# EAGLE schematic Smersh2 (EAGLE 9.1.3)
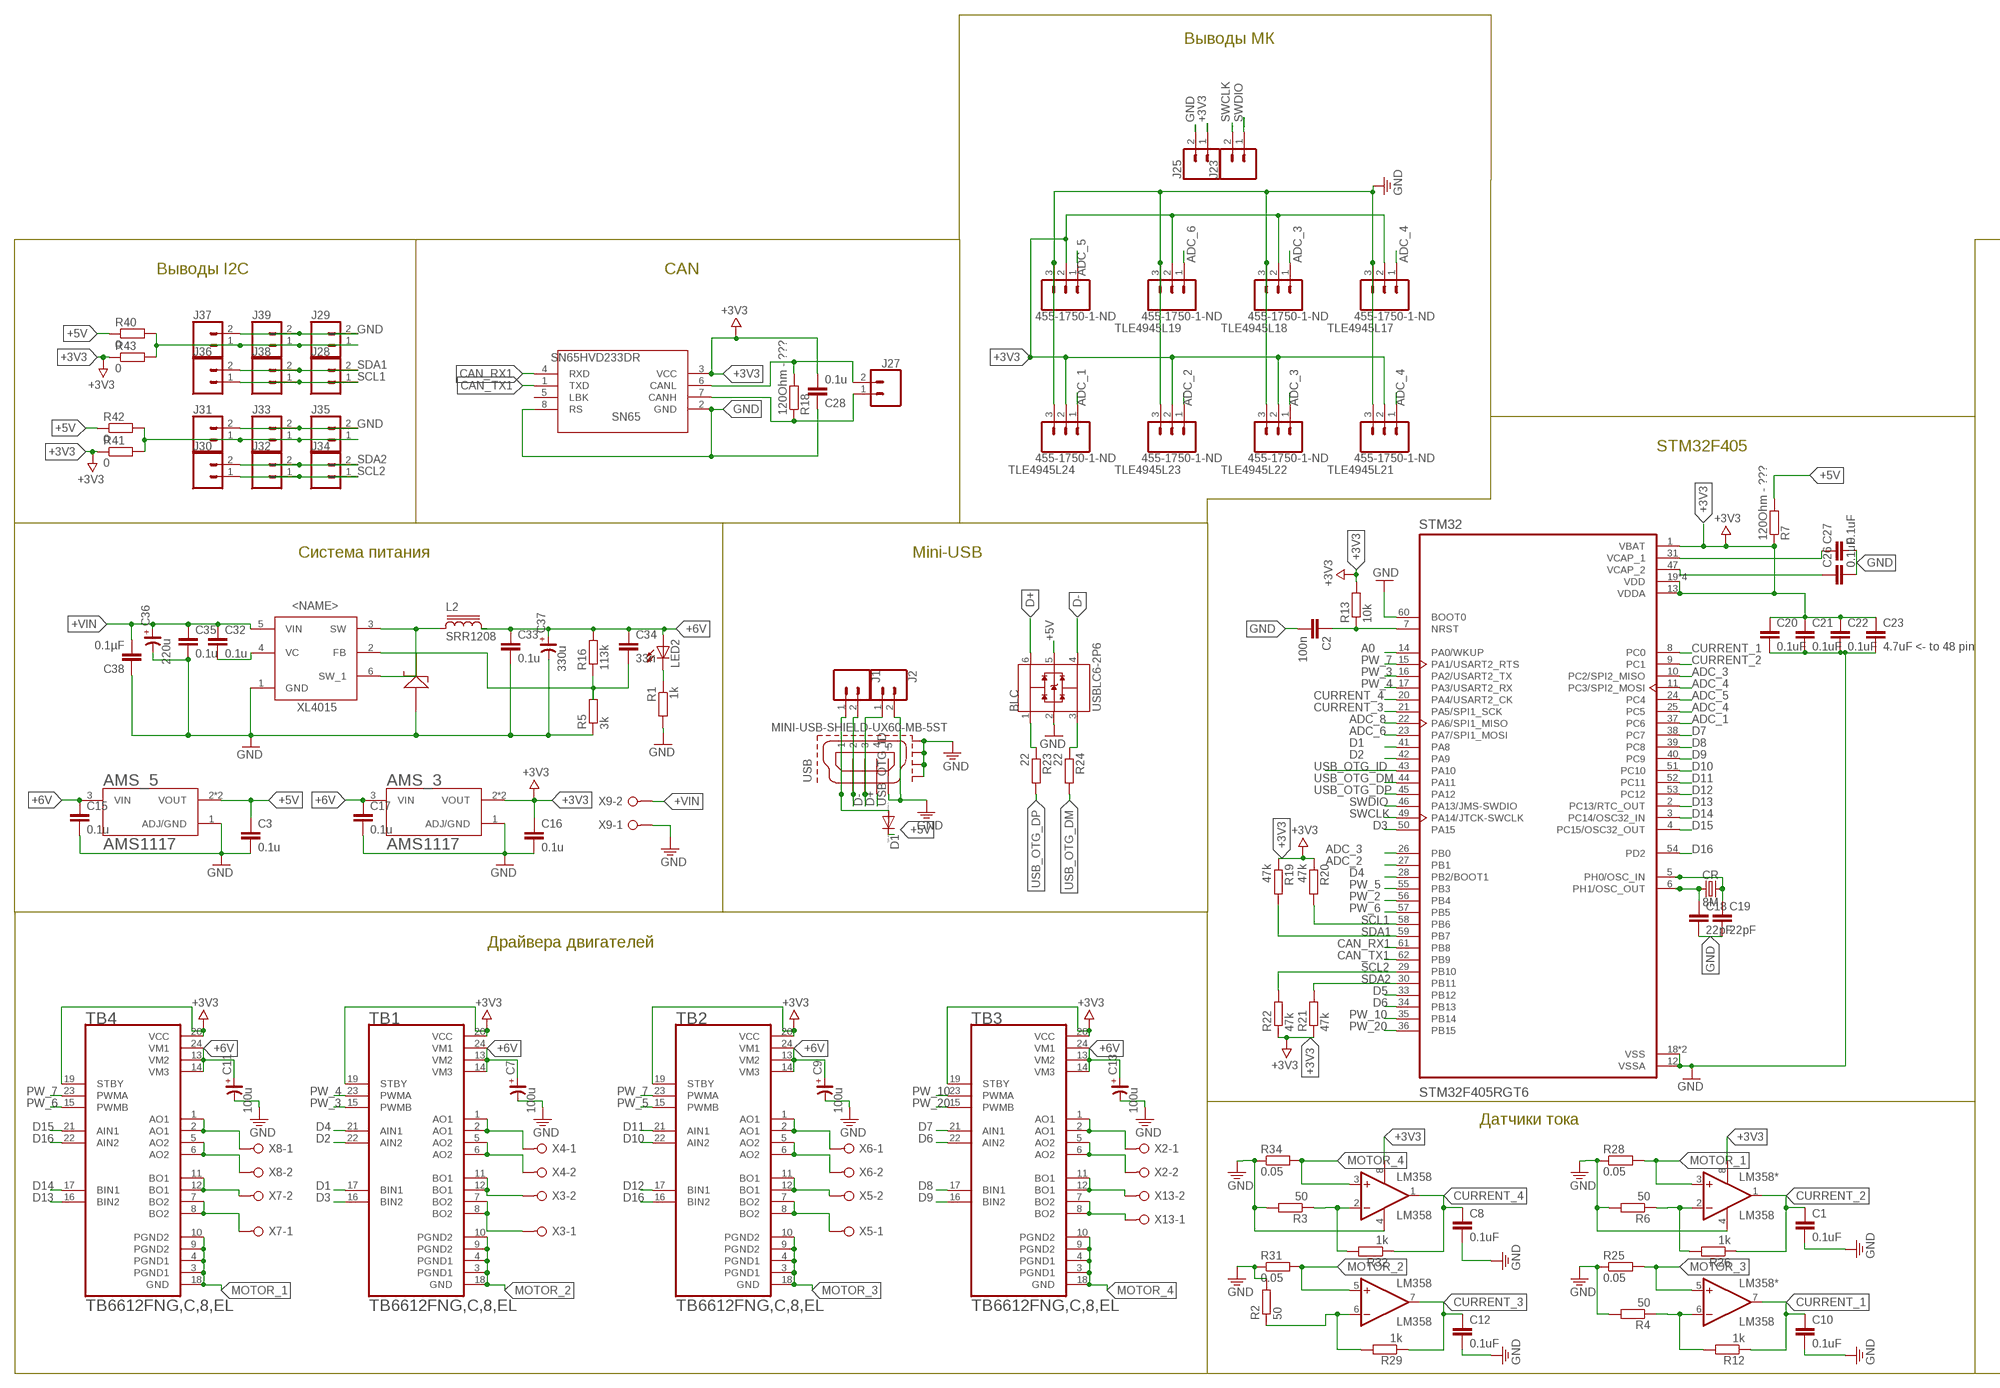
[diagram p0: schematic, sheet 1, part 1 of 2]
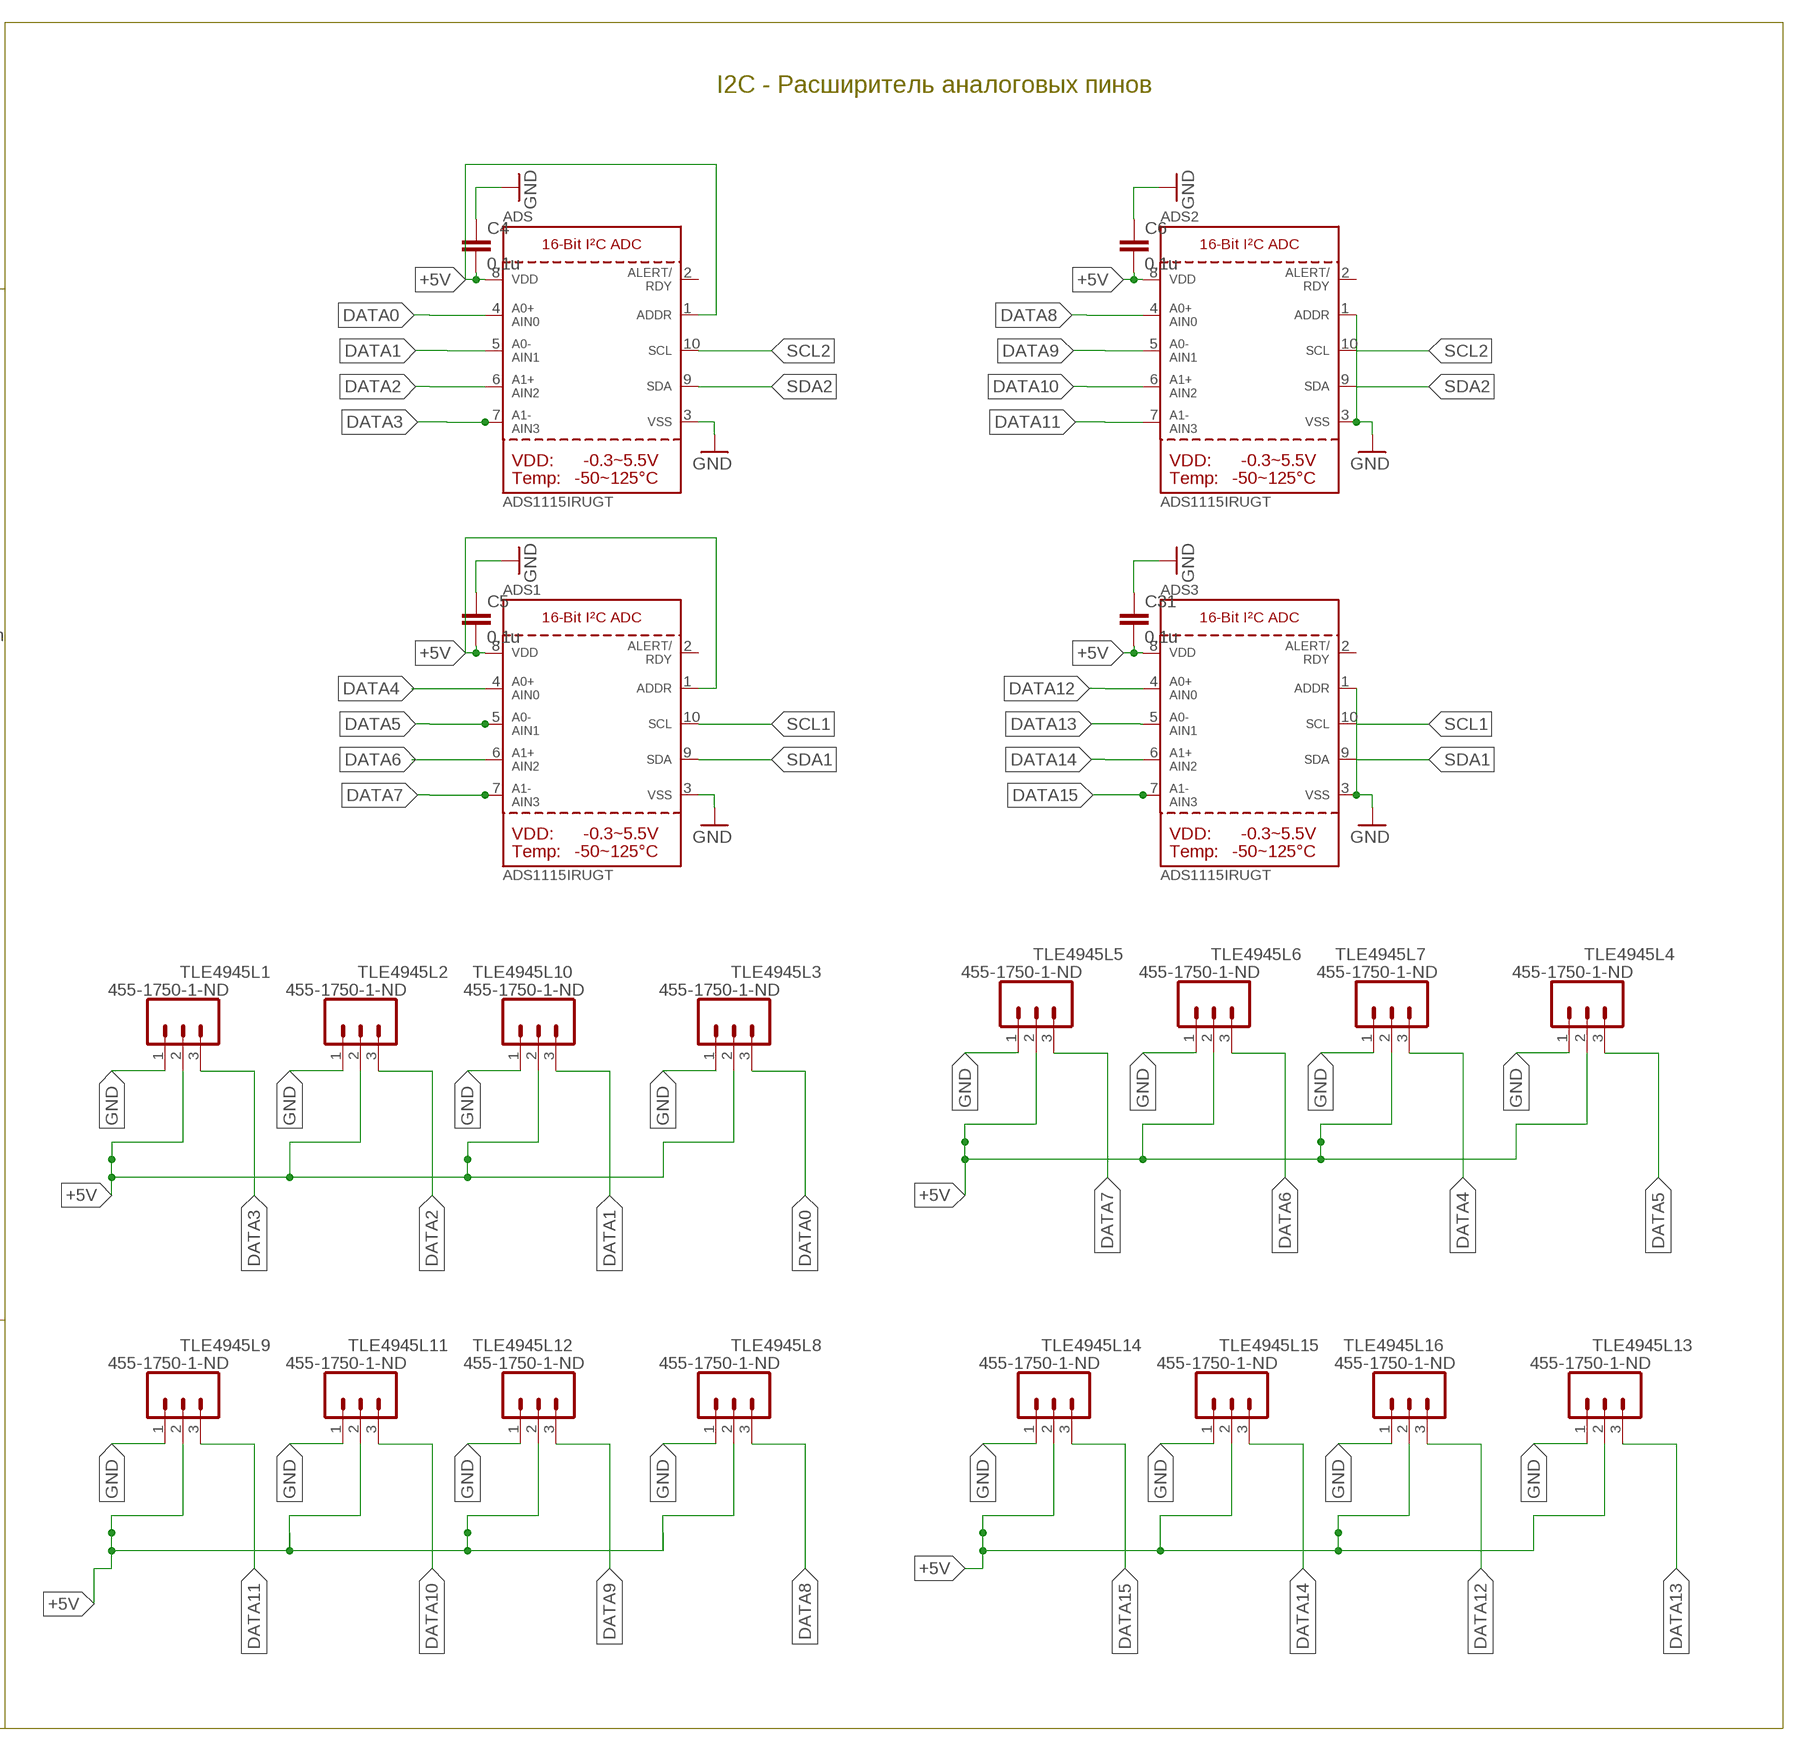
[diagram p1: schematic, sheet 1, part 2 of 2]

## Parts
ADS  ADS1115IRUGT  [MSOP10]
ADS1  ADS1115IRUGT  [MSOP10]
ADS2  ADS1115IRUGT  [MSOP10]
ADS3  ADS1115IRUGT  [MSOP10]
AMS_3  AMS1117  [SOT229P700X180-4N]
AMS_5  AMS1117  [SOT229P700X180-4N]
BLC  USBLC6-2P6  [SOT50P160X60-6N]
C1  0.1uF  C-EUC0603  [C0603]
C2  100n  C-EUC0603  [C0603]
C3  0.1u  C-EUC0805  [C0805]
C4  0.1u  C-EUC0805  [C0805]
C5  0.1u  C-EUC0805  [C0805]
C6  0.1u  C-EUC0805  [C0805]
C7  100u  CP_SV-B  [CSV-B]
C8  0.1uF  C-EUC0603  [C0603]
C9  100u  CP_SV-B  [CSV-B]
C10  0.1uF  C-EUC0603  [C0603]
C11  100u  CP_SV-B  [CSV-B]
C12  0.1uF  C-EUC0603  [C0603]
C13  100u  CP_SV-B  [CSV-B]
C15  0.1u  C-EUC0805  [C0805]
C16  0.1u  C-EUC0805  [C0805]
C17  0.1u  C-EUC0805  [C0805]
C18  22pF  C-EUC0603  [C0603]
C19  22pF  C-EUC0603  [C0603]
C20  0.1uF  C-EUC0805  [C0805]
C21  0.1uF  C-EUC0603  [C0603]
C22  0.1uF  C-EUC0805  [C0805]
C23  4.7uF <- to 48 pin  C-EUC0805  [C0805]
C26  0.1uF  C-EUC0603  [C0603]
C27  0.1uF  C-EUC0603  [C0603]
C28  0.1u  C-EUC0805  [C0805]
C31  0.1u  C-EUC0805  [C0805]
C32  0.1u  C-EUC0805  [C0805]
C33  0.1u  C-EUC0805  [C0805]
C34  33n  C-EUC0805  [C0805]
C35  0.1u  C-EUC0805  [C0805]
C36  220u  CP_SV-D  [CSV-D]
C37  330u  CP_SV-D  [CSV-D]
C38  0.1µF  C-EUC0805  [C0805]
CR  8M  CRYSTALSMD-3.2X2.5  [CRYSTAL-SMD-3.2X2.5MM]
D1  DIODE-MELF-MLL41  [MELF-MLL41]
DIOD  SK54  [DO214AA]
J1  CONN_02  [1X02]
J2  CONN_02  [1X02]
J23  CONN_02  [1X02]
J25  CONN_02  [1X02]
J27  CONN_02  [1X02]
J28  CONN_02  [1X02]
J29  CONN_02  [1X02]
J30  CONN_02  [1X02]
J31  CONN_02  [1X02]
J32  CONN_02  [1X02]
J33  CONN_02  [1X02]
J34  CONN_02  [1X02]
J35  CONN_02  [1X02]
J36  CONN_02  [1X02]
J37  CONN_02  [1X02]
J38  CONN_02  [1X02]
J39  CONN_02  [1X02]
L2  SRR1208  [SSR1208]
LED2  LEDCHIPLED_0805  [CHIPLED_0805]
LM358  LM358  [LM358]
LM358*  LM358  [LM358]
R1  1k  R-EU_R0805  [R0805]
R2  50  R-EU_R0603  [R0603]
R3  50  R-EU_R0603  [R0603]
R4  50  R-EU_R1206  [R1206]
R5  3k  R-EU_M0805  [M0805]
R6  50  R-EU_R0603  [R0603]
R7  120Ohm - ???  R-EU_R0805  [R0805]
R12  1k  R-EU_R0603  [R0603]
R13  10k  R-EU_R0603  [R0603]
R16  113k  R-EU_M0805  [M0805]
R18  120Ohm - ???  R-EU_R0805  [R0805]
R19  47k  R-EU_R0805  [R0805]
R20  47k  R-EU_R0805  [R0805]
R21  47k  R-EU_R0805  [R0805]
R22  47k  R-EU_R0805  [R0805]
R23  22  R-EU_R0805  [R0805]
R24  22  R-EU_R0805  [R0805]
R25  0.05  R-EU_R1206  [R1206]
R26  1k  R-EU_R0603  [R0603]
R28  0.05  R-EU_R1206  [R1206]
R29  1k  R-EU_R0603  [R0603]
R31  0.05  R-EU_R1206  [R1206]
R32  1k  R-EU_R0603  [R0603]
R34  0.05  R-EU_R1206  [R1206]
R40  0  R-EU_R0805  [R0805]
R41  0  R-EU_R0805  [R0805]
R42  0  R-EU_R0805  [R0805]
R43  0  R-EU_R0805  [R0805]
SN65  SN65HVD233DR  [SOIC8]
STM32  STM32F405RGT6  [QFP50P1200X1200X160-64N]
TB1  TB6612FNG,C,8,EL  [SOP65P760X160-24N]
TB2  TB6612FNG,C,8,EL  [SOP65P760X160-24N]
TB3  TB6612FNG,C,8,EL  [SOP65P760X160-24N]
TB4  TB6612FNG,C,8,EL  [SOP65P760X160-24N]
TLE4945L1  455-1750-1-ND  CONN_03  [1X03]
TLE4945L2  455-1750-1-ND  CONN_03  [1X03]
TLE4945L3  455-1750-1-ND  CONN_03  [1X03]
TLE4945L4  455-1750-1-ND  CONN_03  [1X03]
TLE4945L5  455-1750-1-ND  CONN_03  [1X03]
TLE4945L6  455-1750-1-ND  CONN_03  [1X03]
TLE4945L7  455-1750-1-ND  CONN_03  [1X03]
TLE4945L8  455-1750-1-ND  CONN_03  [1X03]
TLE4945L9  455-1750-1-ND  CONN_03  [1X03]
TLE4945L10  455-1750-1-ND  CONN_03  [1X03]
TLE4945L11  455-1750-1-ND  CONN_03  [1X03]
TLE4945L12  455-1750-1-ND  CONN_03  [1X03]
TLE4945L13  455-1750-1-ND  CONN_03  [1X03]
TLE4945L14  455-1750-1-ND  CONN_03  [1X03]
TLE4945L15  455-1750-1-ND  CONN_03  [1X03]
TLE4945L16  455-1750-1-ND  CONN_03  [1X03]
TLE4945L17  455-1750-1-ND  CONN_03  [1X03]
TLE4945L18  455-1750-1-ND  CONN_03  [1X03]
TLE4945L19  455-1750-1-ND  CONN_03  [1X03]
TLE4945L20  455-1750-1-ND  CONN_03  [1X03]
TLE4945L21  455-1750-1-ND  CONN_03  [1X03]
TLE4945L22  455-1750-1-ND  CONN_03  [1X03]
TLE4945L23  455-1750-1-ND  CONN_03  [1X03]
TLE4945L24  455-1750-1-ND  CONN_03  [1X03]
USB  MINI-USB-SHIELD-UX60-MB-5ST  [UX60-MB-5ST]
X2  W237-02P  [W237-132]
X3  W237-02P  [W237-132]
X4  W237-02P  [W237-132]
X5  W237-02P  [W237-132]
X6  W237-02P  [W237-132]
X7  W237-02P  [W237-132]
X8  W237-02P  [W237-132]
X9  W237-02P  [W237-132]
X13  W237-02P  [W237-132]
XL4015  XL4015  [TO263-5L]

## Nets
+3V3: AMS_3.2(VOUT) AMS_3.4(VOUT) C16.1 C20.1 C21.1 C22.1 C23.1 C28.2 J25.1 LM358*.8(V+) LM358.8(V+) R7.1 R13.2 R19.1 R20.1 R21.1 R22.1 R41.1 R43.1 SN65.3(VCC) STM32.1(VBAT) STM32.13(VDDA) STM32.19(VDD) STM32.32(VDD) STM32.48(VDD) STM32.64(VDD) TB1.19(STBY) TB1.20(VCC) TB2.19(STBY) TB2.20(VCC) TB3.19(STBY) TB3.20(VCC) TB4.19(STBY) TB4.20(VCC) TLE4945L17.2 TLE4945L18.2 TLE4945L19.2 TLE4945L20.2 TLE4945L21.2 TLE4945L22.2 TLE4945L23.2 TLE4945L24.2
+5V: ADS1.1(ADDR) ADS1.8(VDD) ADS2.8(VDD) ADS3.8(VDD) ADS.1(ADDR) ADS.8(VDD) AMS_5.2(VOUT) AMS_5.4(VOUT) BLC.5(VBUS) C3.1 C4.2 C5.2 C6.2 C31.2 D1.C R7.2 R40.1 R42.1 TLE4945L1.2 TLE4945L2.2 TLE4945L3.2 TLE4945L4.2 TLE4945L5.2 TLE4945L6.2 TLE4945L7.2 TLE4945L8.2 TLE4945L9.2 TLE4945L10.2 TLE4945L11.2 TLE4945L12.2 TLE4945L13.2 TLE4945L14.2 TLE4945L15.2 TLE4945L16.2
+6V: AMS_3.3(VIN) AMS_5.3(VIN) C7.+ C9.+ C11.+ C13.+ C15.1 C17.1 C33.1 C34.1 C37.+ L2.2 LED2.A R16.2 TB1.13(VM2) TB1.14(VM3) TB1.24(VM1) TB2.13(VM2) TB2.14(VM3) TB2.24(VM1) TB3.13(VM2) TB3.14(VM3) TB3.24(VM1) TB4.13(VM2) TB4.14(VM3) TB4.24(VM1)
+VIN: C32.1 C35.1 C36.+ C38.2 X9.2 XL4015.5(VIN)
A0: STM32.14(PA0/WKUP)
ADC_1: STM32.37(PC6) TLE4945L24.1
ADC_2: STM32.27(PB1) TLE4945L23.1
ADC_3: STM32.10(PC2/SPI2_MISO) STM32.26(PB0) TLE4945L18.1 TLE4945L22.1
ADC_4: STM32.11(PC3/SPI2_MOSI) STM32.25(PC5) TLE4945L17.1 TLE4945L21.1
ADC_5: STM32.24(PC4) TLE4945L20.1
ADC_6: STM32.23(PA7/SPI1_MOSI) TLE4945L19.1
ADC_8: STM32.22(PA6/SPI1_MISO)
CAN_RX1: SN65.4(RXD) STM32.61(PB8)
CAN_TX1: SN65.1(TXD) STM32.62(PB9)
CANH2: J27.1 R18.1 SN65.7(CANH)
CANL2: J27.2 R18.2 SN65.6(CANL)
CURRENT_1: C10.1 LM358*.7(OUT1) R12.1 STM32.8(PC0)
CURRENT_2: C1.1 LM358*.1(OUT) R26.1 STM32.9(PC1)
CURRENT_3: C12.1 LM358.7(OUT1) R29.1 STM32.21(PA5/SPI1_SCK)
CURRENT_4: C8.1 LM358.1(OUT) R32.1 STM32.20(PA4/USART2_CK)
D1: STM32.41(PA8) TB1.17(BIN1)
D2: STM32.42(PA9) TB1.22(AIN2)
D3: STM32.50(PA15) TB1.16(BIN2)
D4: STM32.28(PB2/BOOT1) TB1.21(AIN1)
D5: STM32.33(PB12)
D6: STM32.34(PB13) TB3.22(AIN2)
D7: STM32.38(PC7) TB3.21(AIN1)
D8: STM32.39(PC8) TB3.17(BIN1)
D9: STM32.40(PC9) TB3.16(BIN2)
D10: STM32.51(PC10) TB2.22(AIN2)
D11: STM32.52(PC11) TB2.21(AIN1)
D12: STM32.53(PC12) TB2.17(BIN1)
D13: STM32.2(PC13/RTC_OUT) TB4.16(BIN2)
D14: STM32.3(PC14/OSC32_IN) TB4.17(BIN1)
D15: STM32.4(PC15/OSC32_OUT) TB4.21(AIN1)
D16: STM32.54(PD2) TB2.16(BIN2) TB4.22(AIN2)
D+: BLC.6(I/O1_2) J2.1 USB.3
D-: BLC.4(I/O2_2) J1.2 USB.2
DATA0: ADS.4(AIN0) TLE4945L3.3
DATA1: ADS.5(AIN1) TLE4945L10.3
DATA2: ADS.6(AIN2) TLE4945L2.3
DATA3: ADS.7(AIN3) TLE4945L1.3
DATA4: ADS1.4(AIN0) TLE4945L7.3
DATA5: ADS1.5(AIN1) TLE4945L4.3
DATA6: ADS1.6(AIN2) TLE4945L6.3
DATA7: ADS1.7(AIN3) TLE4945L5.3
DATA8: ADS2.4(AIN0) TLE4945L8.3
DATA9: ADS2.5(AIN1) TLE4945L12.3
DATA10: ADS2.6(AIN2) TLE4945L11.3
DATA11: ADS2.7(AIN3) TLE4945L9.3
DATA12: ADS3.4(AIN0) TLE4945L16.3
DATA13: ADS3.5(AIN1) TLE4945L13.3
DATA14: ADS3.6(AIN2) TLE4945L15.3
DATA15: ADS3.7(AIN3) TLE4945L14.3
GND: ADS1.3(VSS) ADS2.1(ADDR) ADS2.3(VSS) ADS3.1(ADDR) ADS3.3(VSS) ADS.3(VSS) AMS_3.1(ADJ/GND) AMS_5.1(ADJ/GND) BLC.2(GND) C1.2 C2.2 C3.2 C4.1 C5.1 C6.1 C7.- C8.2 C9.- C10.2 C11.- C12.2 C13.- C15.2 C16.2 C17.2 C18.2 C19.2 C20.2 C21.2 C22.2 C23.2 C26.2 C27.2 C28.1 C31.1 C33.2 C35.2 C36.- C37.- C38.1 DIOD.A J2.2 J25.2 J29.2 J31.2 J33.2 J35.2 J37.2 J39.2 LM358*.4(V-) LM358.4(V-) R1.2 R2.2 R3.2 R4.2 R5.1 R6.2 R25.1 R28.1 R31.1 R34.1 SN65.2(GND) SN65.8(RS) STM32.12(VSSA) STM32.18(VSS) STM32.60(BOOT0) STM32.63(VSS) TLE4945L1.1 TLE4945L2.1 TLE4945L3.1 TLE4945L4.1 TLE4945L5.1 TLE4945L6.1 TLE4945L7.1 TLE4945L8.1 TLE4945L9.1 TLE4945L10.1 TLE4945L11.1 TLE4945L12.1 TLE4945L13.1 TLE4945L14.1 TLE4945L15.1 TLE4945L16.1 TLE4945L17.3 TLE4945L18.3 TLE4945L19.3 TLE4945L20.3 TLE4945L21.3 TLE4945L22.3 TLE4945L23.3 TLE4945L24.3 USB.5 USB.M1(GND1) USB.M2(GND2) USB.M3(GND3) USB.M4(GND4) X9.1 XL4015.1(GND)
MOTOR_1: LM358*.3(+IN) R28.2 TB4.3(PGND1) TB4.4(PGND1) TB4.9(PGND2) TB4.10(PGND2) TB4.18(GND)
MOTOR_2: LM358.5(+IN1) R31.2 TB1.3(PGND1) TB1.4(PGND1) TB1.9(PGND2) TB1.10(PGND2) TB1.18(GND)
MOTOR_3: LM358*.5(+IN1) R25.2 TB2.3(PGND1) TB2.4(PGND1) TB2.9(PGND2) TB2.10(PGND2) TB2.18(GND)
MOTOR_4: LM358.3(+IN) R34.2 TB3.3(PGND1) TB3.4(PGND1) TB3.9(PGND2) TB3.10(PGND2) TB3.18(GND)
N$2: LED2.C R1.1
N$3: D1.A J1.1 USB.1
N$6: TB1.1(AO1) TB1.2(AO1) X4.1
N$7: C32.2 XL4015.4(VC)
N$8: TB1.5(AO2) TB1.6(AO2) X4.2
N$9: DIOD.C L2.1 XL4015.3(SW) XL4015.6(SW_1)
N$10: TB1.11(BO1) TB1.12(BO1) X3.2
N$11: TB1.7(BO2) TB1.8(BO2) X3.1
N$12: C2.1 R13.1 STM32.7(NRST)
N$13: C19.1 CR.3 STM32.5(PH0/OSC_IN)
N$14: TB2.1(AO1) TB2.2(AO1) X6.1
N$15: TB2.5(AO2) TB2.6(AO2) X6.2
N$16: C18.1 CR.1 STM32.6(PH1/OSC_OUT)
N$18: TB2.11(BO1) TB2.12(BO1) X5.2
N$22: C26.1 STM32.47(VCAP_2)
N$23: TB2.7(BO2) TB2.8(BO2) X5.1
N$29: LM358*.6(-IN1) R4.1 R12.2
N$31: LM358*.2(-IN) R6.1 R26.2
N$32: C34.2 R5.2 R16.1 XL4015.2(FB)
N$33: TB4.1(AO1) TB4.2(AO1) X8.1
N$34: TB4.5(AO2) TB4.6(AO2) X8.2
N$35: TB4.11(BO1) TB4.12(BO1) X7.2
N$36: TB4.7(BO2) TB4.8(BO2) X7.1
N$38: LM358.6(-IN1) R2.1 R29.2
N$41: TB3.1(AO1) TB3.2(AO1) X2.1
N$42: TB3.5(AO2) TB3.6(AO2) X2.2
N$43: TB3.11(BO1) TB3.12(BO1) X13.2
N$44: TB3.7(BO2) TB3.8(BO2) X13.1
N$45: C27.1 STM32.31(VCAP_1)
N$48: LM358.2(-IN) R3.1 R32.2
N$49: BLC.1(I/O1_1) R23.1
N$50: BLC.3(I/O2_1) R24.1
N$53: J31.1 J33.1 J35.1 R41.2 R42.2
N$55: J29.1 J37.1 J39.1 R40.2 R43.2
PW_2: STM32.56(PB4)
PW_3: STM32.16(PA2/USART2_TX) TB1.15(PWMB)
PW_4: STM32.17(PA3/USART2_RX) TB1.23(PWMA)
PW_5: STM32.55(PB3) TB2.15(PWMB)
PW_6: STM32.57(PB5) TB4.15(PWMB)
PW_7: STM32.15(PA1/USART2_RTS) TB2.23(PWMA) TB4.23(PWMA)
PW_10: STM32.35(PB14) TB3.23(PWMA)
PW_20: STM32.36(PB15) TB3.15(PWMB)
SCL1: ADS1.10(SCL) ADS3.10(SCL) J28.1 J36.1 J38.1 R20.2 STM32.58(PB6)
SCL2: ADS2.10(SCL) ADS.10(SCL) J30.1 J32.1 J34.1 R22.2 STM32.29(PB10)
SDA1: ADS1.9(SDA) ADS3.9(SDA) J28.2 J36.2 J38.2 R19.2 STM32.59(PB7)
SDA2: ADS2.9(SDA) ADS.9(SDA) J30.2 J32.2 J34.2 R21.2 STM32.30(PB11)
SWCLK: J23.2 STM32.49(PA14/JTCK-SWCLK)
SWDIO: J23.1 STM32.46(PA13/JMS-SWDIO)
USB_OTG_DM: R24.2 STM32.44(PA11)
USB_OTG_DP: R23.2 STM32.45(PA12)
USB_OTG_ID: STM32.43(PA10) USB.4
Unconnected: ADS1.2(ALERT/RDY) ADS2.2(ALERT/RDY) ADS3.2(ALERT/RDY) ADS.2(ALERT/RDY) SN65.5(LBK)

## Notes on the sheet
- Выводы МК
- Выводы I2C | CAN
- Фитолента | I2C - Расширитель аналоговых пинов
- STM32F405
- Система питания | Mini-USB
- Драйвера двигателей
- Датчики тока

## Library data of the parts
ADS ADS1-ADS3 = ADS1115IRUGT:ADS1115IRUGT: 16-Bit Del-Sig ADC Four single-ended inputs or two differential inputs Internal PGA I2C interface 2.0-5.5V; AVAILABILITY: Unavailable; DESCRIPTION: 16 Bit Analog to Digital Converter 2, 4 Input 1 Sigma-Delta 10-X2QFN _2x1.5_; MF: Texas Instruments; MP: ADS1115IRUGT; PACKAGE: XFQFN-10 Texas Instruments; PRICE: None
AMS_3 AMS_5 = AMS1117:AMS1117: Sot223/Pkg 1-Amp 5-Volt Low Drop Out Voltage Regulatator; AVAILABILITY: Unavailable; DESCRIPTION: 1A LOW DROPOUT VOLTAGE REGULATOR; MF: Seeed Technology; MP: AMS1117; PACKAGE: SOT-223 Seeed Technology; PRICE: None
BLC = USBLC6-2P6:USBLC6-2P6: The USBLC6-2SC6 and USBLC6-2P6 are monolithic application specific devices dedicated to ESD protection of high speed interfaces, such as USB 2.0, Ethernet links and video lines. The very low line capacitance secures a high level of signal integrity without compromising in protecting sensitive chips against the most stringently characterized ESD strikes; AVAILABILITY: Unavailable; DESCRIPTION: 17V Clamp 5A _8/20µs_ Ipp Tvs Diode Surface Mount SOT-666; MF: STMicroelectronics; MP: USBLC62P6; PACKAGE: SOT-563 STMicroelectronics; PRICE: None
C1-C6 C8 C10 C12 C15-C23 C26-C28 C31-C35 = resistor:C-EU: CAPACITOR, European symbol
C7 C9 C11 C13 C36 C37 = rc-master-smd:CP_: POLARIZED CAP
C38 = rcl:C-EU: CAPACITOR, European symbol
CR = SparkFun-Clocks:CRYSTAL: Crystals (Generic) These are passive quartz crystals, which can be used as a clock source for a microcontroller. Crystal's are two-terminal devices. They require external "load" capacitors to generate an oscillating signal.
D1 = diode:DIODE-: DIODE
DIOD = DO214AA:SK54
J1 J2 J23 J25 J27-J39 = SparkFun-Connectors:CONN_02: Multi connection point. Often used as Generic Header-pin footprint for 0.1 inch spaced/style header connections On any of the 0.1 inch spaced packages, you can populate with these: Break Away Headers - Straight <https://www.sparkfun.com/products/116> (PRT-00116) Break Away Male Headers - Right Angle <https://www.sparkfun.com/products/553> (PRT-00553) Female Headers <https://www.sparkfun.com/products/115> (PRT-00115) Break Away Headers - Machine Pin <https://www.sparkfun.com/products/117> (PRT-00117) Break Away Female Headers - Swiss Machine Pin <https://www.sparkfun.com/products/743> (PRT-00743) For SCREWTERMINALS and SPRING TERMINALS visit here: Screw Terimnals on SparkFun.com <https://www.sparkfun.com/search/results?term=Screw+Terminals> (5mm/3.5mm/2.54mm spacing) This device is also useful as a general connection point to wire up your design to another part of your project. Our various solder wires solder well into these plated through hole pads. Hook-Up Wire - Assortment (Stranded, 22 AWG) <https://www.sparkfun.com/products/11375> (PRT-11375) Hook-Up Wire - Assortment (Solid Core, 22 AWG) <https://www.sparkfun.com/products/11367> (PRT-11367) View the entire wire category on our website here <https://www.sparkfun.com/categories/141> Special notes: Molex polarized connector foot print use with: PRT-08233 with associated crimp pins and housings. 2.54_SCREWTERM for use with PRT-10571. 3.5mm Screw Terminal footprints for PRT-08084 5mm Screw Terminal footprints for use with PRT-08432
L2 = srr1208:SRR1208: POWER INDUCTOR
LED2 = led:LED: LED OSRAM: - CHIPLED LG R971, LG N971, LY N971, LG Q971, LY Q971, LO R971, LY R971 LH N974, LH R974 LS Q976, LO Q976, LY Q976 LO Q996 - Hyper CHIPLED LW Q18S LB Q993, LB Q99A, LB R99A - SideLED LS A670, LO A670, LY A670, LG A670, LP A670 LB A673, LV A673, LT A673, LW A673 LH A674 LY A675 LS A676, LA A676, LO A676, LY A676, LW A676 LS A679, LY A679, LG A679 - Hyper Micro SIDELED® LS Y876, LA Y876, LO Y876, LY Y876 LT Y87S - SmartLED LW L88C, LW L88S LB L89C, LB L89S, LG L890 LS L89K, LO L89K, LY L89K LS L896, LA L896, LO L896, LY L896 - TOPLED LS T670, LO T670, LY T670, LG T670, LP T670 LSG T670, LSP T670, LSY T670, LOP T670, LYG T670 LG T671, LOG T671, LSG T671 LB T673, LV T673, LT T673, LW T673 LH T674 LS T676, LA T676, LO T676, LY T676, LB T676, LH T676, LSB T676, LW T676 LB T67C, LV T67C, LT T67C, LS T67K, LO T67K, LY T67K, LW E67C LS E67B, LA E67B, LO E67B, LY E67B, LB E67C, LV E67C, LT E67C LW T67C LS T679, LY T679, LG T679 LS T770, LO T770, LY T770, LG T770, LP T770 LB T773, LV T773, LT T773, LW T773 LH T774 LS E675, LA E675, LY E675, LS T675 LS T776, LA T776, LO T776, LY T776, LB T776 LHGB T686 LT T68C, LB T68C - Hyper Mini TOPLED® LB M676 - Mini TOPLED Santana® LG M470 LS M47K, LO M47K, LY M47K Source: http://www.osram.convergy.de LUXEON: - LUMILED® LXK2-PW12-R00, LXK2-PW12-S00, LXK2-PW14-U00, LXK2-PW14-V00 LXK2-PM12-R00, LXK2-PM12-S00, LXK2-PM14-U00 LXK2-PE12-Q00, LXK2-PE12-R00, LXK2-PE12-S00, LXK2-PE14-T00, LXK2-PE14-U00 LXK2-PB12-K00, LXK2-PB12-L00, LXK2-PB12-M00, LXK2-PB14-N00, LXK2-PB14-P00, LXK2-PB14-Q00 LXK2-PR12-L00, LXK2-PR12-M00, LXK2-PR14-Q00, LXK2-PR14-R00 LXK2-PD12-Q00, LXK2-PD12-R00, LXK2-PD12-S00 LXK2-PH12-R00, LXK2-PH12-S00 LXK2-PL12-P00, LXK2-PL12-Q00, LXK2-PL12-R00 Source: www.luxeon.com KINGBRIGHT: KA-3528ASYC Source: www.kingbright.com
LM358 LM358* = lm358:LM358
R1 = rcl:R-EU_: RESISTOR, European symbol
R2-R4 R6 R7 R12 R13 R18-R26 R28 R29 R31 R32 R34 R40-R43 = resistor:R-EU_: RESISTOR, European symbol
R5 R16 = rcl@1:R-EU_: RESISTOR, European symbol; SPICEPREFIX: R
SN65 = SN65HVD233DR:SN65HVD233DR; AVAILABILITY: Unavailable; DESCRIPTION: 3.3V CAN Transceiver with Standby Mode, Loop-back 8-SOIC -40 to 125; MF: Texas Instruments; MP: SN65HVD233DR; PACKAGE: SOIC-8 Texas Instruments; PRICE: None
STM32 = STM32F405RGT6:STM32F405RGT6: High-performance foundation line, ARM Cortex-M4 core with DSP and FPU, 1 Mbyte Flash, 168 MHz CPU, ART Accelerator; AVAILABILITY: Unavailable; DESCRIPTION: ARM® Cortex®-M4 STM32F4 Microcontroller IC 32-Bit 168MHz 1MB _1M x 8_ FLASH 64-LQFP _10x10_; MF: STMicroelectronics; MP: STM32F405RGT6; PACKAGE: LQFP-64 STMicroelectronics; PRICE: None
TB1-TB4 = TB6612FNG_C_8_EL:TB6612FNG,C,8,EL: Stepping Motor Driver Ic Unipolor Copper Wire 8"; AVAILABILITY: Unavailable; DESCRIPTION: Motor Driver Power MOSFET Parallel 24-SSOP; MF: Toshiba; MP: TB6612FNG,C,8,EL; PACKAGE: SSOP-24 Toshiba; PRICE: None
TLE4945L1-TLE4945L24 = SparkFun-Connectors:CONN_03: Multi connection point. Often used as Generic Header-pin footprint for 0.1 inch spaced/style header connections On any of the 0.1 inch spaced packages, you can populate with these: Break Away Headers - Straight <https://www.sparkfun.com/products/116> (PRT-00116) Break Away Male Headers - Right Angle <https://www.sparkfun.com/products/553> (PRT-00553) Female Headers <https://www.sparkfun.com/products/115> (PRT-00115) Break Away Headers - Machine Pin <https://www.sparkfun.com/products/117> (PRT-00117) Break Away Female Headers - Swiss Machine Pin <https://www.sparkfun.com/products/743> (PRT-00743) Stackable Header - 3 Pin (Female, 0.1") <https://www.sparkfun.com/products/13875> (PRT-13875) For SCREWTERMINALS and SPRING TERMINALS visit here: Screw Terimnals on SparkFun.com <https://www.sparkfun.com/search/results?term=Screw+Terminals> (5mm/3.5mm/2.54mm spacing) This device is also useful as a general connection point to wire up your design to another part of your project. Our various solder wires solder well into these plated through hole pads. Hook-Up Wire - Assortment (Stranded, 22 AWG) <https://www.sparkfun.com/products/11375> (PRT-11375) Hook-Up Wire - Assortment (Solid Core, 22 AWG) <https://www.sparkfun.com/products/11367> (PRT-11367) View the entire wire category on our website here <https://www.sparkfun.com/categories/141> Special notes: Molex polarized connector foot print use with SKU : PRT-08232 with associated crimp pins and housings.; PROD_ID: XXX-00000
USB = usb_con-update:MINI-USB-SHIELD-: MINI USB Connector Source: http://www.hirose.co.jp/cataloge_hp/e24000019.pdf
X2-X9 X13 = con-wago-508:W237-02P: WAGO SREW CLAMP; OC_FARNELL: unknown; OC_NEWARK: unknown
XL4015 = XL4015:XL4015

## Net classes
0 default: clearance 0.205 mm